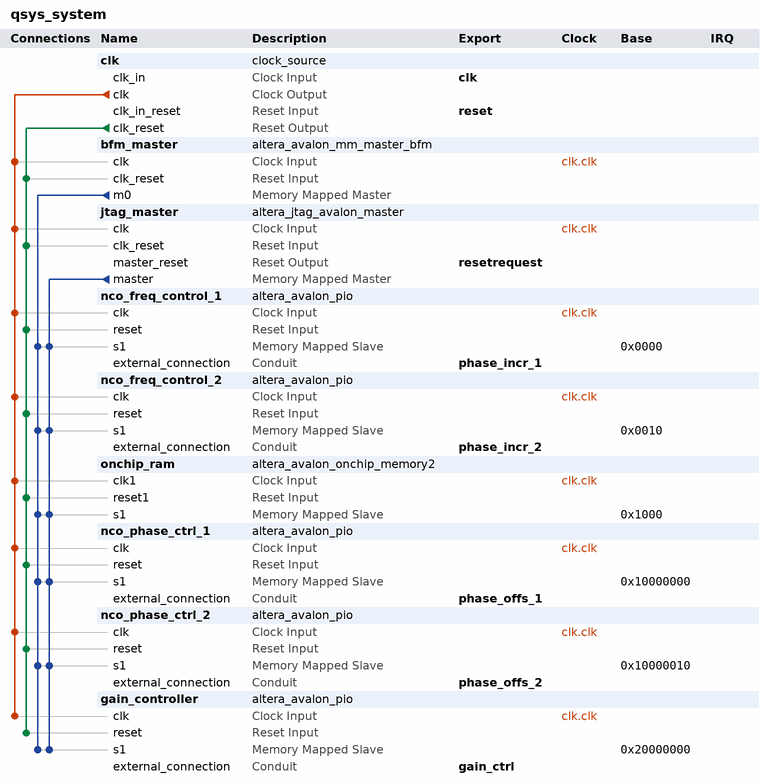
[diagram p0: system contents]
# Platform Designer (Qsys) system qsys_system, Cyclone IV E EP4CE115F29C7
# Parameters at their usual value, and those the tool derives, are not listed.
package require -exact qsys 16.0
create_system qsys_system
set_project_property DEVICE_FAMILY {Cyclone IV E}
set_project_property DEVICE EP4CE115F29C7

add_instance clk clock_source 16.0
set_instance_parameter_value clk clockFrequency 50000000

add_instance bfm_master altera_avalon_mm_master_bfm 16.0
set_instance_parameter_value bfm_master ADDRESS_UNITS SYMBOLS
set_instance_parameter_value bfm_master AV_ADDRESS_W 32
set_instance_parameter_value bfm_master AV_ALWAYS_BURST_MAX_BURST 0
set_instance_parameter_value bfm_master AV_BURSTCOUNT_W 3
set_instance_parameter_value bfm_master AV_BURST_BNDR_ONLY 1
set_instance_parameter_value bfm_master AV_BURST_LINEWRAP 1
set_instance_parameter_value bfm_master AV_CONSTANT_BURST_BEHAVIOR 1
set_instance_parameter_value bfm_master AV_FIX_READ_LATENCY 1
set_instance_parameter_value bfm_master AV_MAX_PENDING_WRITES 0
set_instance_parameter_value bfm_master AV_NUMSYMBOLS 4
set_instance_parameter_value bfm_master AV_READRESPONSE_W 8
set_instance_parameter_value bfm_master AV_READ_WAIT_TIME 1
set_instance_parameter_value bfm_master AV_WRITERESPONSE_W 8
set_instance_parameter_value bfm_master USE_BURSTCOUNT 0
set_instance_parameter_value bfm_master USE_BYTE_ENABLE 1
set_instance_parameter_value bfm_master USE_READ 1
set_instance_parameter_value bfm_master USE_READ_DATA 1
set_instance_parameter_value bfm_master USE_READ_DATA_VALID 1
set_instance_parameter_value bfm_master USE_WAIT_REQUEST 1
set_instance_parameter_value bfm_master VHDL_ID 0

add_instance jtag_master altera_jtag_avalon_master 16.0

add_instance nco_freq_control_1 altera_avalon_pio 16.0
set_instance_parameter_value nco_freq_control_1 direction Output
set_instance_parameter_value nco_freq_control_1 resetValue 1310
set_instance_parameter_value nco_freq_control_1 width 20

add_instance nco_freq_control_2 altera_avalon_pio 16.0
set_instance_parameter_value nco_freq_control_2 direction Output
set_instance_parameter_value nco_freq_control_2 width 20

add_instance onchip_ram altera_avalon_onchip_memory2 16.0
set_instance_parameter_value onchip_ram dataWidth 32
set_instance_parameter_value onchip_ram dualPort false
set_instance_parameter_value onchip_ram initMemContent false
set_instance_parameter_value onchip_ram initializationFileName onchip_mem.hex
set_instance_parameter_value onchip_ram memorySize 4096

add_instance nco_phase_ctrl_1 altera_avalon_pio 16.0
set_instance_parameter_value nco_phase_ctrl_1 direction Output
set_instance_parameter_value nco_phase_ctrl_1 width 20

add_instance nco_phase_ctrl_2 altera_avalon_pio 16.0
set_instance_parameter_value nco_phase_ctrl_2 direction Output
set_instance_parameter_value nco_phase_ctrl_2 width 20

add_instance gain_controller altera_avalon_pio 16.0
set_instance_parameter_value gain_controller direction Output
set_instance_parameter_value gain_controller width 6

# connections
add_connection clk.clk bfm_master.clk clock
add_connection clk.clk gain_controller.clk clock
add_connection clk.clk jtag_master.clk clock
add_connection clk.clk nco_freq_control_1.clk clock
add_connection clk.clk nco_freq_control_2.clk clock
add_connection clk.clk nco_phase_ctrl_1.clk clock
add_connection clk.clk nco_phase_ctrl_2.clk clock
add_connection clk.clk onchip_ram.clk1 clock
add_connection clk.clk_reset bfm_master.clk_reset reset
add_connection clk.clk_reset gain_controller.reset reset
add_connection clk.clk_reset jtag_master.clk_reset reset
add_connection clk.clk_reset nco_freq_control_1.reset reset
add_connection clk.clk_reset nco_freq_control_2.reset reset
add_connection clk.clk_reset nco_phase_ctrl_1.reset reset
add_connection clk.clk_reset nco_phase_ctrl_2.reset reset
add_connection clk.clk_reset onchip_ram.reset1 reset
add_connection bfm_master.m0 gain_controller.s1 avalon
set_connection_parameter_value bfm_master.m0/gain_controller.s1 baseAddress 0x20000000
add_connection bfm_master.m0 nco_freq_control_1.s1 avalon
set_connection_parameter_value bfm_master.m0/nco_freq_control_1.s1 baseAddress 0x0000
add_connection bfm_master.m0 nco_freq_control_2.s1 avalon
set_connection_parameter_value bfm_master.m0/nco_freq_control_2.s1 baseAddress 0x0010
add_connection bfm_master.m0 nco_phase_ctrl_1.s1 avalon
set_connection_parameter_value bfm_master.m0/nco_phase_ctrl_1.s1 baseAddress 0x10000000
add_connection bfm_master.m0 nco_phase_ctrl_2.s1 avalon
set_connection_parameter_value bfm_master.m0/nco_phase_ctrl_2.s1 baseAddress 0x10000010
add_connection bfm_master.m0 onchip_ram.s1 avalon
set_connection_parameter_value bfm_master.m0/onchip_ram.s1 baseAddress 0x1000
add_connection jtag_master.master gain_controller.s1 avalon
set_connection_parameter_value jtag_master.master/gain_controller.s1 baseAddress 0x20000000
add_connection jtag_master.master nco_freq_control_1.s1 avalon
set_connection_parameter_value jtag_master.master/nco_freq_control_1.s1 baseAddress 0x0000
add_connection jtag_master.master nco_freq_control_2.s1 avalon
set_connection_parameter_value jtag_master.master/nco_freq_control_2.s1 baseAddress 0x0010
add_connection jtag_master.master nco_phase_ctrl_1.s1 avalon
set_connection_parameter_value jtag_master.master/nco_phase_ctrl_1.s1 baseAddress 0x10000000
add_connection jtag_master.master nco_phase_ctrl_2.s1 avalon
set_connection_parameter_value jtag_master.master/nco_phase_ctrl_2.s1 baseAddress 0x10000010
add_connection jtag_master.master onchip_ram.s1 avalon
set_connection_parameter_value jtag_master.master/onchip_ram.s1 baseAddress 0x1000

# exported interfaces
add_interface clk clock sink
set_interface_property clk EXPORT_OF clk.clk_in
add_interface gain_ctrl conduit end
set_interface_property gain_ctrl EXPORT_OF gain_controller.external_connection
add_interface phase_incr_1 conduit end
set_interface_property phase_incr_1 EXPORT_OF nco_freq_control_1.external_connection
add_interface phase_incr_2 conduit end
set_interface_property phase_incr_2 EXPORT_OF nco_freq_control_2.external_connection
add_interface phase_offs_1 conduit end
set_interface_property phase_offs_1 EXPORT_OF nco_phase_ctrl_1.external_connection
add_interface phase_offs_2 conduit end
set_interface_property phase_offs_2 EXPORT_OF nco_phase_ctrl_2.external_connection
add_interface reset reset sink
set_interface_property reset EXPORT_OF clk.clk_in_reset
add_interface resetrequest reset source
set_interface_property resetrequest EXPORT_OF jtag_master.master_reset

set_interconnect_requirement {$system} qsys_mm.clockCrossingAdapter HANDSHAKE
set_interconnect_requirement {$system} qsys_mm.enableEccProtection FALSE
set_interconnect_requirement {$system} qsys_mm.insertDefaultSlave FALSE
set_interconnect_requirement {$system} qsys_mm.maxAdditionalLatency 1

save_system qsys_system.qsys
